# Altium schematic sheet BLOCK[5-8].SchDoc
size A3; SheetNumber: 2; SheetTotal: 3
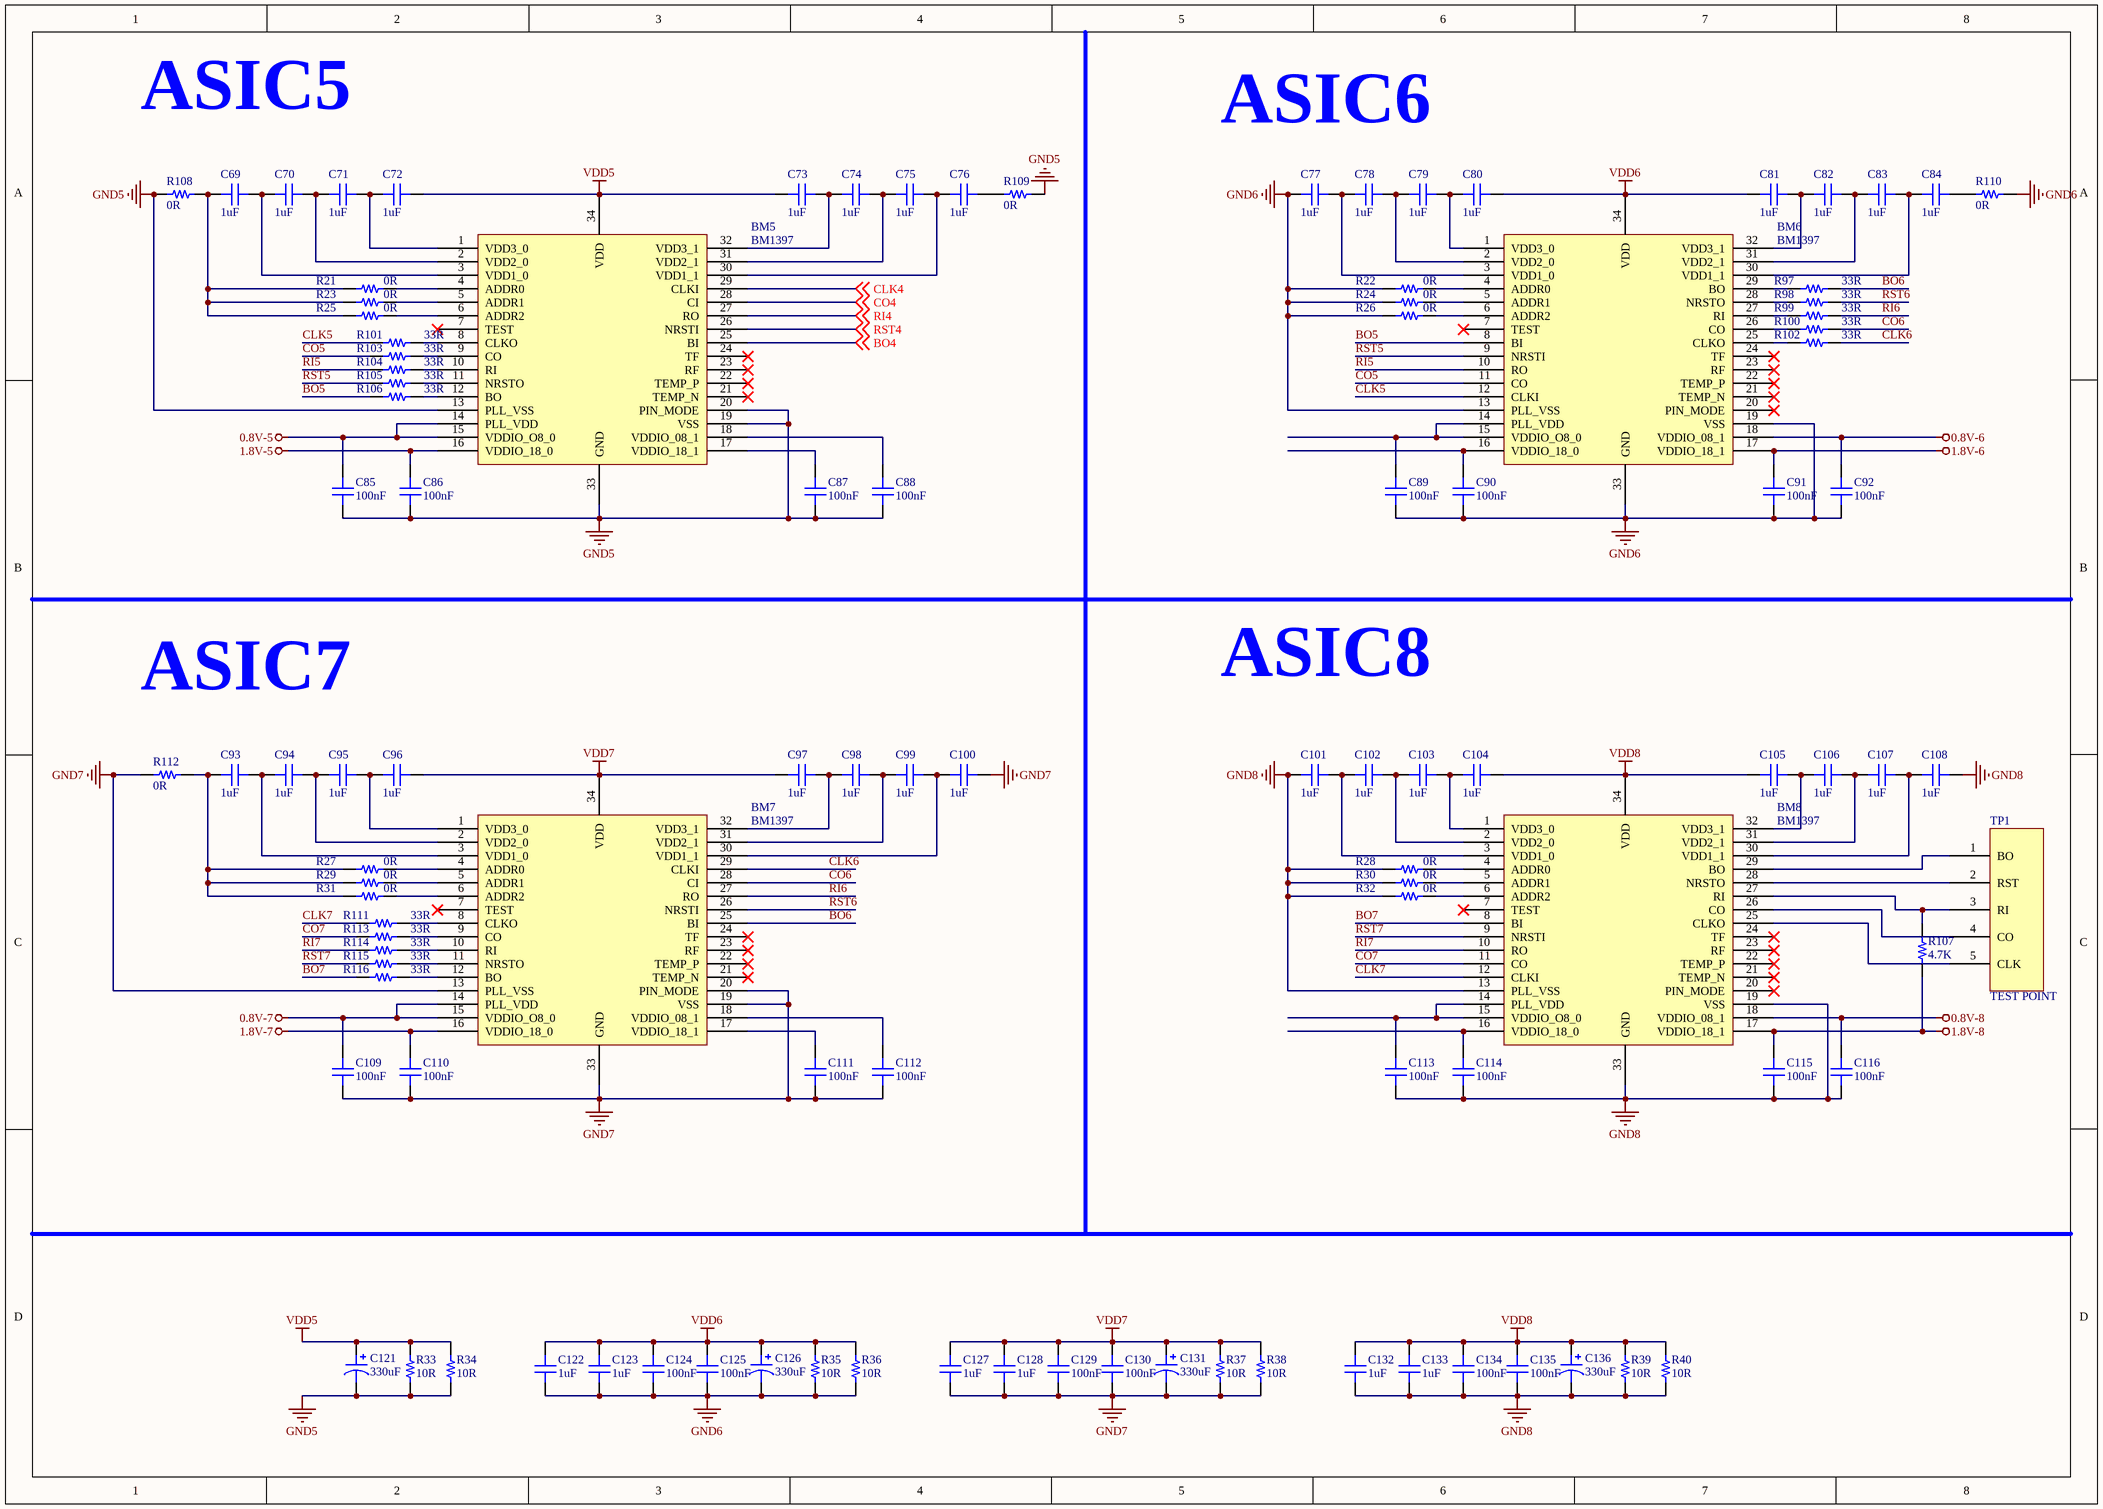
[diagram p0: BLOCK[5-8].SchDoc]

## Parts
BM5  BM1397  [BM1387]
BM6  BM1397  [BM1387]
BM7  BM1397  [BM1387]
BM8  BM1397  [BM1387]
C69  1uF  [CAP-SMD-0402]
C70  1uF  [CAP-SMD-0402]
C71  1uF  [CAP-SMD-0402]
C72  1uF  [CAP-SMD-0402]
C73  1uF  [CAP-SMD-0402]
C74  1uF  [CAP-SMD-0402]
C75  1uF  [CAP-SMD-0402]
C76  1uF  [CAP-SMD-0402]
C77  1uF  [CAP-SMD-0402]
C78  1uF  [CAP-SMD-0402]
C79  1uF  [CAP-SMD-0402]
C80  1uF  [CAP-SMD-0402]
C81  1uF  [CAP-SMD-0402]
C82  1uF  [CAP-SMD-0402]
C83  1uF  [CAP-SMD-0402]
C84  1uF  [CAP-SMD-0402]
C85  100nF  [CAP-SMD-0603]
C86  100nF  [CAP-SMD-0603]
C87  100nF  [CAP-SMD-0603]
C88  100nF  [CAP-SMD-0603]
C89  100nF  [CAP-SMD-0603]
C90  100nF  [CAP-SMD-0603]
C91  100nF  [CAP-SMD-0603]
C92  100nF  [CAP-SMD-0603]
C93  1uF  [CAP-SMD-0402]
C94  1uF  [CAP-SMD-0402]
C95  1uF  [CAP-SMD-0402]
C96  1uF  [CAP-SMD-0402]
C97  1uF  [CAP-SMD-0402]
C98  1uF  [CAP-SMD-0402]
C99  1uF  [CAP-SMD-0402]
C100  1uF  [CAP-SMD-0402]
C101  1uF  [CAP-SMD-0402]
C102  1uF  [CAP-SMD-0402]
C103  1uF  [CAP-SMD-0402]
C104  1uF  [CAP-SMD-0402]
C105  1uF  [CAP-SMD-0402]
C106  1uF  [CAP-SMD-0402]
C107  1uF  [CAP-SMD-0402]
C108  1uF  [CAP-SMD-0402]
C109  100nF  [CAP-SMD-0603]
C110  100nF  [CAP-SMD-0603]
C111  100nF  [CAP-SMD-0603]
C112  100nF  [CAP-SMD-0603]
C113  100nF  [CAP-SMD-0603]
C114  100nF  [CAP-SMD-0603]
C115  100nF  [CAP-SMD-0603]
C116  100nF  [CAP-SMD-0603]
C121  330uF  [CAP-TAN-CASE-E]
C122  1uF  [CAP-SMD-0603]
C123  1uF  [CAP-SMD-0603]
C124  100nF  [CAP-SMD-0603]
C125  100nF  [CAP-SMD-0603]
C126  330uF  [CAP-TAN-CASE-E]
C127  1uF  [CAP-SMD-0603]
C128  1uF  [CAP-SMD-0603]
C129  100nF  [CAP-SMD-0603]
C130  100nF  [CAP-SMD-0603]
C131  330uF  [CAP-TAN-CASE-E]
C132  1uF  [CAP-SMD-0603]
C133  1uF  [CAP-SMD-0603]
C134  100nF  [CAP-SMD-0603]
C135  100nF  [CAP-SMD-0603]
C136  330uF  [CAP-TAN-CASE-E]
R21  0R  [RES-SMD-0402]
R22  0R  [RES-SMD-0402]
R23  0R  [RES-SMD-0402]
R24  0R  [RES-SMD-0402]
R25  0R  [RES-SMD-0402]
R26  0R  [RES-SMD-0402]
R27  0R  [RES-SMD-0402]
R28  0R  [RES-SMD-0402]
R29  0R  [RES-SMD-0402]
R30  0R  [RES-SMD-0402]
R31  0R  [RES-SMD-0402]
R32  0R  [RES-SMD-0402]
R33  10R  [RES-SMD-1210]
R34  10R  [RES-SMD-1210]
R35  10R  [RES-SMD-1210]
R36  10R  [RES-SMD-1210]
R37  10R  [RES-SMD-1210]
R38  10R  [RES-SMD-1210]
R39  10R  [RES-SMD-1210]
R40  10R  [RES-SMD-1210]
R97  33R  [RES-SMD-1206]
R98  33R  [RES-SMD-1206]
R99  33R  [RES-SMD-1206]
R100  33R  [RES-SMD-1206]
R101  33R  [RES-SMD-1206]
R102  33R  [RES-SMD-1206]
R103  33R  [RES-SMD-1206]
R104  33R  [RES-SMD-1206]
R105  33R  [RES-SMD-1206]
R106  33R  [RES-SMD-1206]
R107  4.7K  [RES-SMD-0402]
R108  0R  [RES]
R109  0R  [RES]
R110  0R  [RES]
R111  33R  [RES-SMD-1206]
R112  0R  [RES]
R113  33R  [RES-SMD-1206]
R114  33R  [RES-SMD-1206]
R115  33R  [RES-SMD-1206]
R116  33R  [RES-SMD-1206]
TP1  TEST POINT  [TEST_POINT]

## Nets
0.8V-5: BM5.14(PLL_VDD) BM5.15(VDDIO_O8_0) C85.2
0.8V-6: BM6.18(VDDIO_08_1) C92.2
0.8V-7: BM7.14(PLL_VDD) BM7.15(VDDIO_O8_0) C109.2
0.8V-8: BM8.18(VDDIO_08_1) C116.2
1.8V-5: BM5.16(VDDIO_18_0) C86.2
1.8V-6: BM6.17(VDDIO_18_1) C91.2
1.8V-7: BM7.16(VDDIO_18_0) C110.2
1.8V-8: BM8.17(VDDIO_18_1) C115.2 R107.1
GND5: BM5.13(PLL_VSS) BM5.19(VSS) BM5.20(PIN_MODE) BM5.33(GND) C85.1 C86.1 C87.1 C88.1 C121.2 R33.1 R34.1 R108.1 R109.2
GND6: BM6.13(PLL_VSS) BM6.19(VSS) BM6.33(GND) C77.1 C89.1 C90.1 C91.1 C92.1 C122.1 C123.1 C124.1 C125.1 C126.2 R22.1 R24.1 R26.1 R35.1 R36.1 R110.2
GND7: BM7.13(PLL_VSS) BM7.19(VSS) BM7.20(PIN_MODE) BM7.33(GND) C100.2 C109.1 C110.1 C111.1 C112.1 C127.1 C128.1 C129.1 C130.1 C131.2 R37.1 R38.1 R112.1
GND8: BM8.13(PLL_VSS) BM8.19(VSS) BM8.33(GND) C101.1 C108.2 C113.1 C114.1 C115.1 C116.1 C132.1 C133.1 C134.1 C135.1 C136.2 R28.1 R30.1 R32.1 R39.1 R40.1
VDD5: BM5.34(VDD) C72.2 C73.1 C121.1 R33.2 R34.2
VDD6: BM6.34(VDD) C80.2 C81.1 C122.2 C123.2 C124.2 C125.2 C126.1 R35.2 R36.2
VDD7: BM7.34(VDD) C96.2 C97.1 C127.2 C128.2 C129.2 C130.2 C131.1 R37.2 R38.2
VDD8: BM8.34(VDD) C104.2 C105.1 C132.2 C133.2 C134.2 C135.2 C136.1 R39.2 R40.2
BO4: BM5.25(BI) ; off-sheet BO4
BO5: BM6.8(BI) R106.1
BO6: BM7.25(BI) R97.2
BO7: BM8.8(BI) R116.1
CLK4: BM5.29(CLKI) ; off-sheet CLK4
CLK5: BM6.12(CLKI) R101.1
CLK6: BM7.29(CLKI) R102.2
CLK7: BM8.12(CLKI) R111.1
CO4: BM5.28(CI) ; off-sheet CO4
CO5: BM6.11(CO) R103.1
CO6: BM7.28(CI) R100.2
CO7: BM8.11(CO) R113.1
RI4: BM5.27(RO) ; off-sheet RI4
RI5: BM6.10(RO) R104.1
RI6: BM7.27(RO) R99.2
RI7: BM8.10(RO) R114.1
RST4: BM5.26(NRSTI) ; off-sheet RST4
RST5: BM6.9(NRSTI) R105.1
RST6: BM7.26(NRSTI) R98.2
RST7: BM8.9(NRSTI) R115.1
NetBM5_1: BM5.1(VDD3_0) C71.2 C72.1
NetBM5_2: BM5.2(VDD2_0) C70.2 C71.1
NetBM5_3: BM5.3(VDD1_0) C69.2 C70.1
NetBM5_4: BM5.4(ADDR0) R21.2
NetBM5_5: BM5.5(ADDR1) R23.2
NetBM5_6: BM5.6(ADDR2) R25.2
NetBM5_8: BM5.8(CLKO) R101.2
NetBM5_9: BM5.9(CO) R103.2
NetBM5_10: BM5.10(RI) R104.2
NetBM5_11: BM5.11(NRSTO) R105.2
NetBM5_12: BM5.12(BO) R106.2
NetBM5_17: BM5.17(VDDIO_18_1) C87.2
NetBM5_18: BM5.18(VDDIO_08_1) C88.2
NetBM5_30: BM5.30(VDD1_1) C75.2 C76.1
NetBM5_31: BM5.31(VDD2_1) C74.2 C75.1
NetBM5_32: BM5.32(VDD3_1) C73.2 C74.1
NetBM6_1: BM6.1(VDD3_0) C79.2 C80.1
NetBM6_2: BM6.2(VDD2_0) C78.2 C79.1
NetBM6_3: BM6.3(VDD1_0) C77.2 C78.1
NetBM6_4: BM6.4(ADDR0) R22.2
NetBM6_5: BM6.5(ADDR1) R24.2
NetBM6_6: BM6.6(ADDR2) R26.2
NetBM6_14: BM6.14(PLL_VDD) BM6.15(VDDIO_O8_0) C89.2
NetBM6_16: BM6.16(VDDIO_18_0) C90.2
NetBM6_25: BM6.25(CLKO) R102.1
NetBM6_26: BM6.26(CO) R100.1
NetBM6_27: BM6.27(RI) R99.1
NetBM6_28: BM6.28(NRSTO) R98.1
NetBM6_29: BM6.29(BO) R97.1
NetBM6_30: BM6.30(VDD1_1) C83.2 C84.1
NetBM6_31: BM6.31(VDD2_1) C82.2 C83.1
NetBM6_32: BM6.32(VDD3_1) C81.2 C82.1
NetBM7_1: BM7.1(VDD3_0) C95.2 C96.1
NetBM7_2: BM7.2(VDD2_0) C94.2 C95.1
NetBM7_3: BM7.3(VDD1_0) C93.2 C94.1
NetBM7_4: BM7.4(ADDR0) R27.2
NetBM7_5: BM7.5(ADDR1) R29.2
NetBM7_6: BM7.6(ADDR2) R31.2
NetBM7_8: BM7.8(CLKO) R111.2
NetBM7_9: BM7.9(CO) R113.2
NetBM7_10: BM7.10(RI) R114.2
NetBM7_11: BM7.11(NRSTO) R115.2
NetBM7_12: BM7.12(BO) R116.2
NetBM7_17: BM7.17(VDDIO_18_1) C111.2
NetBM7_18: BM7.18(VDDIO_08_1) C112.2
NetBM7_30: BM7.30(VDD1_1) C99.2 C100.1
NetBM7_31: BM7.31(VDD2_1) C98.2 C99.1
NetBM7_32: BM7.32(VDD3_1) C97.2 C98.1
NetBM8_1: BM8.1(VDD3_0) C103.2 C104.1
NetBM8_2: BM8.2(VDD2_0) C102.2 C103.1
NetBM8_3: BM8.3(VDD1_0) C101.2 C102.1
NetBM8_4: BM8.4(ADDR0) R28.2
NetBM8_5: BM8.5(ADDR1) R30.2
NetBM8_6: BM8.6(ADDR2) R32.2
NetBM8_14: BM8.14(PLL_VDD) BM8.15(VDDIO_O8_0) C113.2
NetBM8_16: BM8.16(VDDIO_18_0) C114.2
NetBM8_25: BM8.25(CLKO) TP1.5(CLK)
NetBM8_26: BM8.26(CO) TP1.4(CO)
NetBM8_27: BM8.27(RI) R107.2 TP1.3(RI)
NetBM8_28: BM8.28(NRSTO) TP1.2(RST)
NetBM8_29: BM8.29(BO) TP1.1(BO)
NetBM8_30: BM8.30(VDD1_1) C107.2 C108.1
NetBM8_31: BM8.31(VDD2_1) C106.2 C107.1
NetBM8_32: BM8.32(VDD3_1) C105.2 C106.1
NetC69_1: C69.1 R21.1 R23.1 R25.1 R108.2
NetC76_2: C76.2 R109.1
NetC84_2: C84.2 R110.1
NetC93_1: C93.1 R27.1 R29.1 R31.1 R112.2

Not connected (* = marked no-connect by the designer): BM5 7(TEST)* 21(TEMP_N)* 22(TEMP_P)* 23(RF)* 24(TF)*; BM6 7(TEST)* 20(PIN_MODE)* 21(TEMP_N)* 22(TEMP_P)* 23(RF)* 24(TF)*; BM7 7(TEST)* 21(TEMP_N)* 22(TEMP_P)* 23(RF)* 24(TF)*; BM8 7(TEST)* 20(PIN_MODE)* 21(TEMP_N)* 22(TEMP_P)* 23(RF)* 24(TF)*

## Notes on the sheet
- ASIC5
- ASIC6
- ASIC7
- ASIC8

## Library data of the parts
BM5 BM7 = BM1397_0
BM6 BM8 = BM1397_1
C69-C116 C122-C125 C127-C130 C132-C135 = CAP
C121 C126 C131 C136 = POLARIZED CAP
R21-R40 R97-R116 = RES